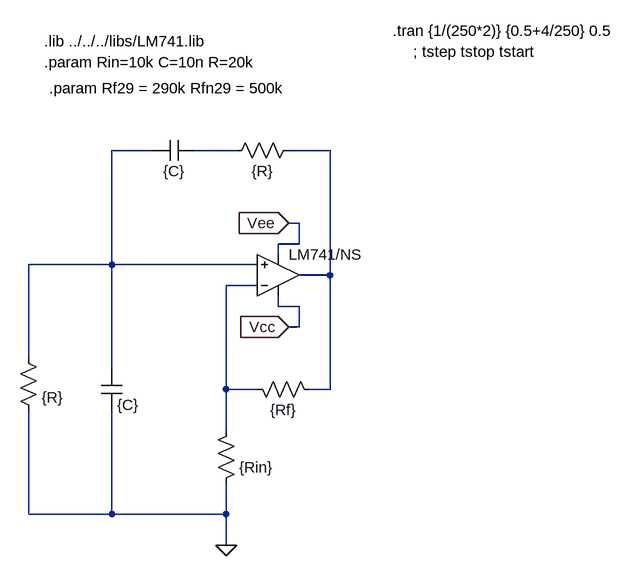
[diagram p0: schematic circuit.asc]
circuit.asc, the LTspice schematic file:
Version 4
SHEET 1 928 680
WIRE 64 -128 0 -128
WIRE 192 -128 128 -128
WIRE 336 -128 272 -128
WIRE 288 -16 272 -16
WIRE 288 16 288 -16
WIRE 288 16 256 16
WIRE 256 32 256 16
WIRE 0 48 0 -128
WIRE 0 48 -128 48
WIRE 224 48 0 48
WIRE 336 64 336 -128
WIRE 336 64 288 64
WIRE 0 208 0 48
WIRE 224 80 176 80
WIRE 256 112 256 96
WIRE 288 112 256 112
WIRE 288 144 288 112
WIRE 288 144 272 144
WIRE -128 192 -128 48
WIRE 176 240 176 80
WIRE 224 240 176 240
WIRE 336 240 336 64
WIRE 336 240 304 240
WIRE 176 304 176 240
WIRE -128 432 -128 272
WIRE 0 432 0 272
WIRE 0 432 -128 432
WIRE 176 432 176 384
WIRE 176 432 0 432
WIRE 176 480 176 432
FLAG 272 144 Vcc
IOPIN 272 144 In
FLAG 272 -16 Vee
IOPIN 272 -16 In
FLAG 176 480 0
SYMBOL opamp2 256 128 M180
WINDOW 0 16 32 Invisible 2
SYMATTR InstName U1
SYMATTR Value LM741/NS
SYMBOL res 320 256 M270
WINDOW 0 32 56 Invisible 2
WINDOW 3 0 56 VBottom 2
SYMATTR InstName R1
SYMATTR Value {Rf}
SYMBOL res 160 400 M180
WINDOW 0 36 76 Invisible 2
WINDOW 3 36 40 Left 2
SYMATTR InstName R2
SYMATTR Value {Rin}
SYMBOL res -144 176 R0
WINDOW 0 36 40 Invisible 2
SYMATTR InstName R3
SYMATTR Value {R}
SYMBOL cap -16 208 R0
WINDOW 0 24 8 Invisible 2
SYMATTR InstName C1
SYMATTR Value {C}
SYMBOL res 288 -144 R90
WINDOW 0 0 56 Invisible 2
WINDOW 3 32 56 VTop 2
SYMATTR InstName R4
SYMATTR Value {R}
SYMBOL cap 128 -144 R90
WINDOW 0 0 32 Invisible 2
WINDOW 3 32 32 VTop 2
SYMATTR InstName C2
SYMATTR Value {C}
TEXT -104 -296 Left 2 !.lib ../../../libs/LM741.lib
TEXT -104 -264 Left 2 !.param Rin=10k C=10n R=20k
TEXT 432 -312 Left 2 !.tran {1/(250*2)} {0.5+4/250} 0.5
TEXT 464 -280 Left 2 !; tstep tstop tstart
TEXT -96 -224 Left 2 !.param Rf29 = 290k Rfn29 = 500k

The netlist it stands for:
* circuit.asc
XU1 N001 N004 Vcc Vee N003 LM741/NS  ; pins In+ In- V+ V- OUT
R1 N003 N004 {Rf}
R2 0 N004 {Rin}
R3 N001 0 {R}
C1 N001 0 {C}
R4 N003 N002 {R}
C2 N002 N001 {C}
.lib ../../../libs/LM741.lib
.param Rin=10k C=10n R=20k
.tran {1/(250*2)} {0.5+4/250} 0.5
; tstep tstop tstart
.param Rf29 = 290k Rfn29 = 500k
.backanno
.end